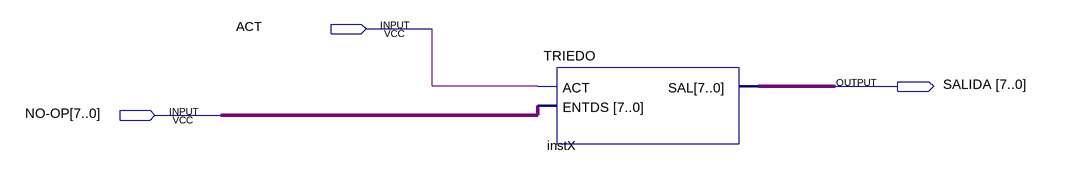
[diagram p0: schematic sheet]
// Quartus schematic NO-OP.bdf as structural Verilog: 1 symbols, 3 pins
module \NO-OP  (
  input  ACT,
  input  [7:0] \NO-OP ,
  output [7:0] SALIDA
);

  TRIEDO instX (.ACT(ACT), .ENTDS(\NO-OP ), .SAL(SALIDA));
endmodule
